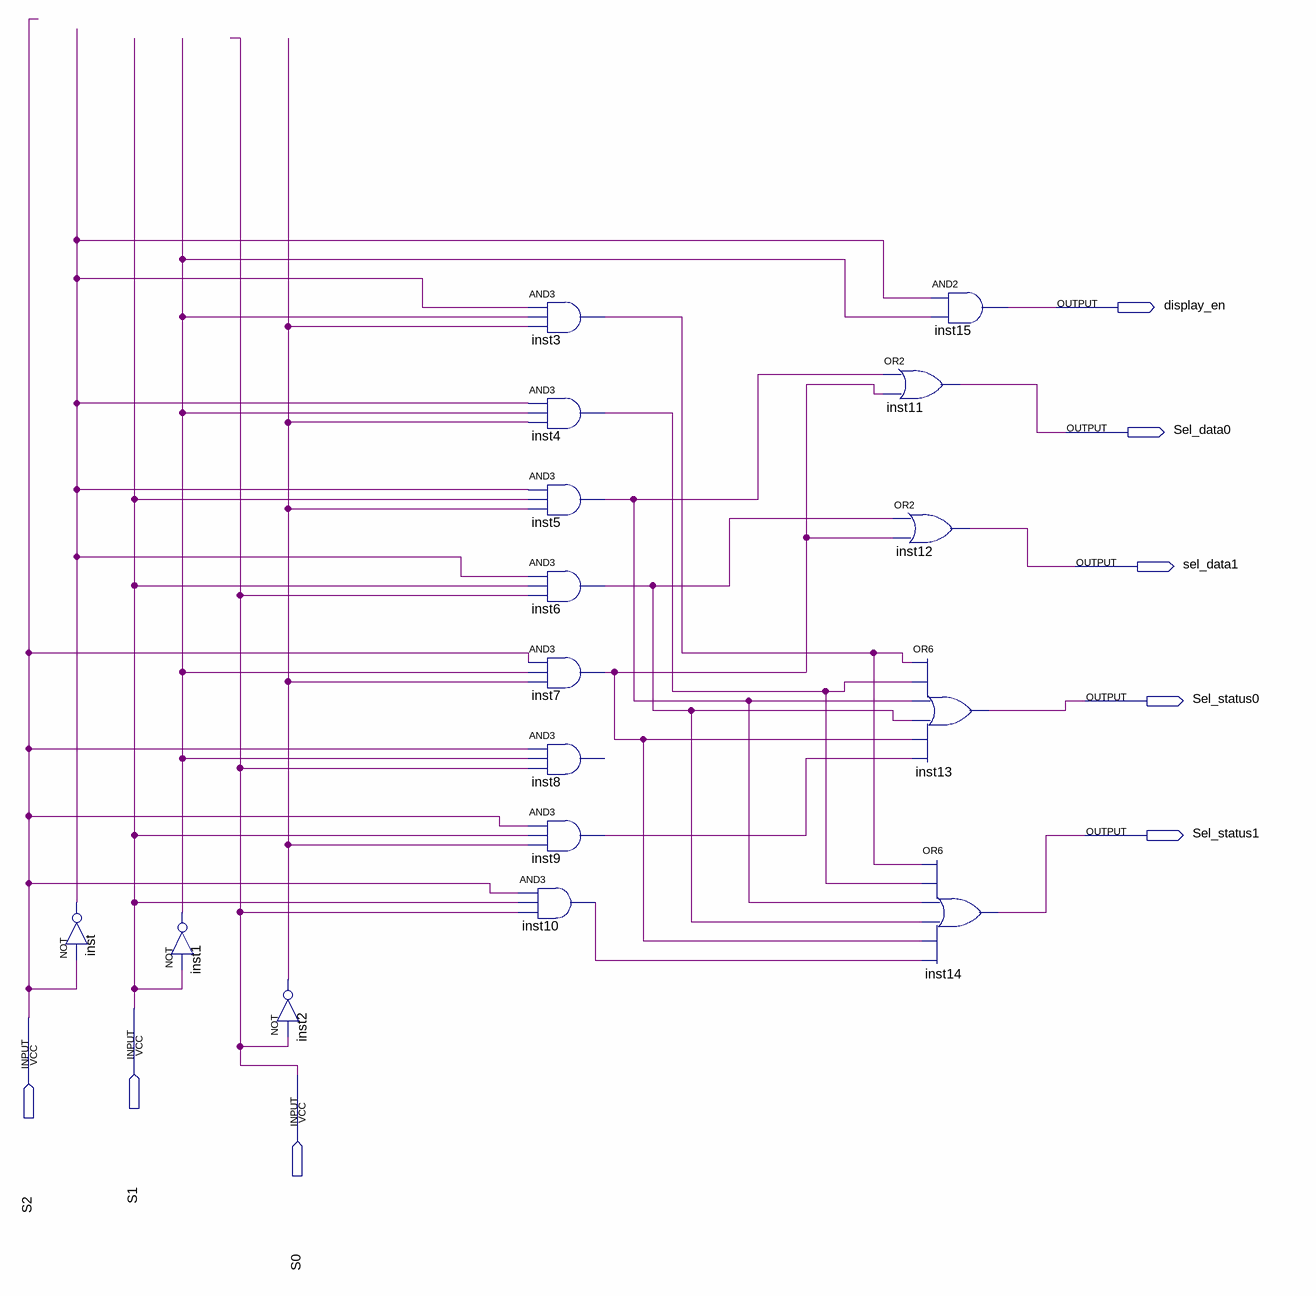
[diagram p0: schematic sheet]
// Quartus schematic dec_alu.bdf as structural Verilog: 16 symbols, 8 pins
module dec_alu (
  input  S1,
  input  S2,
  input  S0,
  output display_en,
  output Sel_data0,
  output sel_data1,
  output Sel_status0,
  output Sel_status1
);

  wire inst1_out, inst2_out, inst3_out, inst4_out, inst5_out, inst6_out, inst7_out, inst9_out, inst10_out,
       inst_out;

  not inst (inst_out, S2);
  not inst1 (inst1_out, S1);
  not inst2 (inst2_out, S0);
  and inst3 (inst3_out, inst_out, inst1_out, inst2_out);
  and inst4 (inst4_out, inst_out, inst1_out, inst2_out);
  and inst5 (inst5_out, inst_out, S1, inst2_out);
  and inst6 (inst6_out, inst_out, S1, S0);
  and inst7 (inst7_out, S2, inst1_out, inst2_out);
  // AND3 inst8 has open pins: IN1=S2, IN2=inst1_out, IN3=S0, OUT=open
  and inst9 (inst9_out, S2, S1, inst2_out);
  and inst10 (inst10_out, S2, S1, S0);
  and inst15 (display_en, inst_out, inst1_out);
  or inst11 (Sel_data0, inst5_out, inst7_out);
  or inst12 (sel_data1, inst6_out, inst7_out);
  or inst13 (Sel_status0, inst3_out, inst4_out, inst5_out, inst6_out, inst7_out, inst9_out);
  or inst14 (Sel_status1, inst3_out, inst4_out, inst5_out, inst6_out, inst7_out, inst10_out);
endmodule
